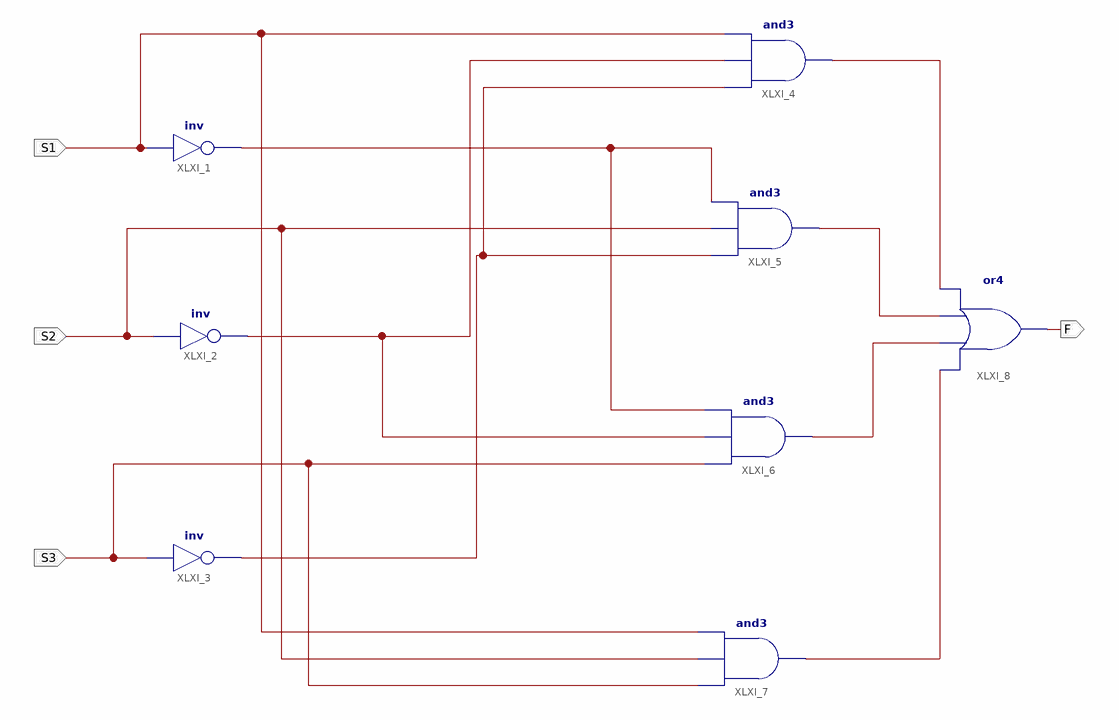
[diagram p0: schematic sheet 1]
// Xilinx ISE schematic LampCtrl.sch (kintex7) as structural Verilog: 8 symbols, 4 ports
module LampCtrl (
  input  S1,
  input  S2,
  input  S3,
  output F
);

  wire XLXN_12, XLXN_14, XLXN_19, XLXN_25, XLXN_27, XLXN_28, XLXN_30;

  not XLXI_1 (XLXN_14, S1);
  not XLXI_2 (XLXN_27, S2);
  not XLXI_3 (XLXN_12, S3);
  and XLXI_4 (XLXN_19, XLXN_12, XLXN_27, S1);
  and XLXI_5 (XLXN_25, XLXN_12, S2, XLXN_14);
  and XLXI_6 (XLXN_28, S3, XLXN_27, XLXN_14);
  and XLXI_7 (XLXN_30, S3, S2, S1);
  or XLXI_8 (F, XLXN_30, XLXN_28, XLXN_25, XLXN_19);
endmodule
